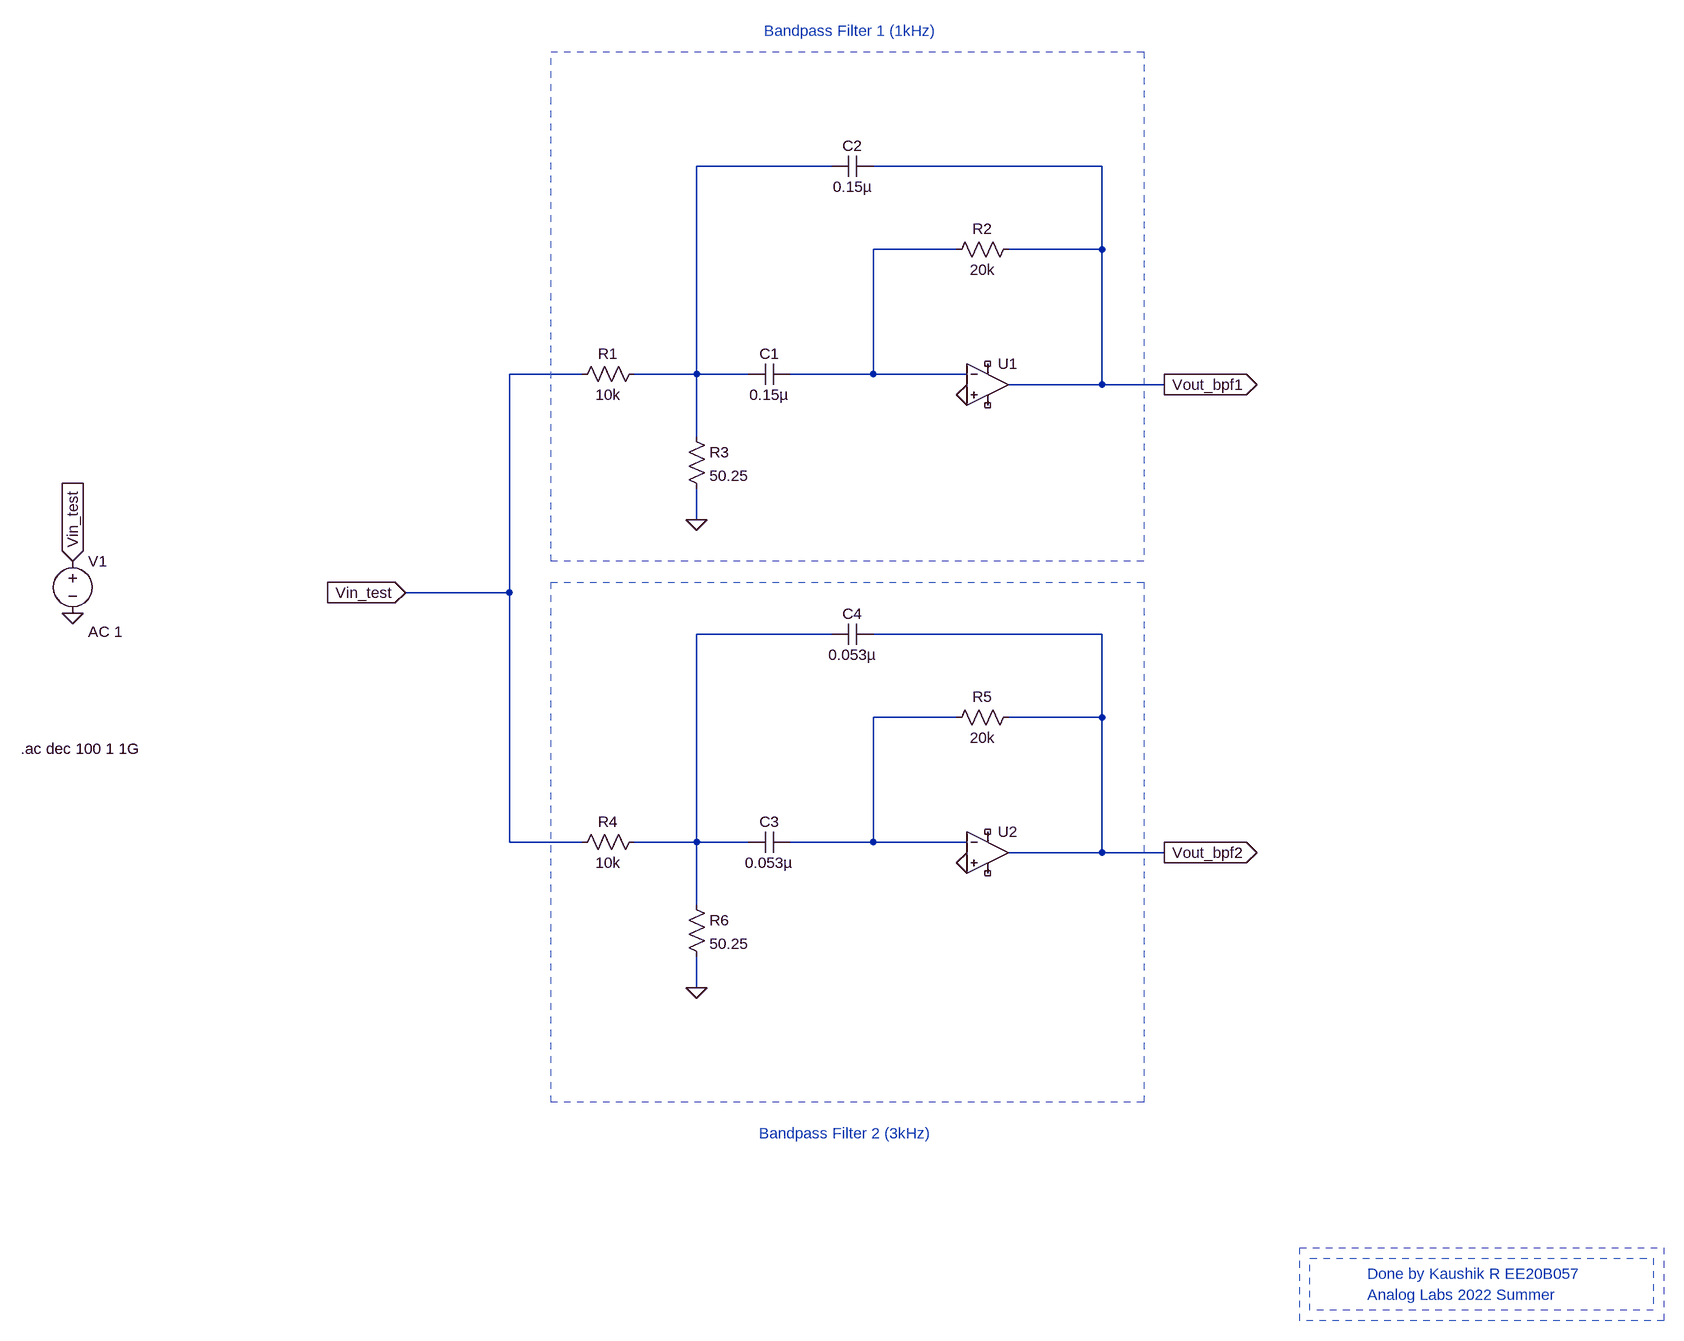
[diagram p0: schematic Exp_6_Bode_Analysis.asc]
Exp_6_Bode_Analysis.asc, the LTspice schematic file:
Version 4
SHEET 1 2004 1428
WIRE 720 -352 512 -352
WIRE 1136 -352 784 -352
WIRE 912 -224 784 -224
WIRE 1136 -224 1136 -352
WIRE 1136 -224 992 -224
WIRE 336 -32 224 -32
WIRE 512 -32 512 -352
WIRE 512 -32 416 -32
WIRE 592 -32 512 -32
WIRE 784 -32 784 -224
WIRE 784 -32 656 -32
WIRE 928 -32 784 -32
WIRE 1136 -16 1136 -224
WIRE 1136 -16 992 -16
WIRE 1232 -16 1136 -16
WIRE 512 64 512 -32
WIRE 512 192 512 144
WIRE 224 304 224 -32
WIRE 224 304 64 304
WIRE 720 368 512 368
WIRE 1136 368 784 368
WIRE 912 496 784 496
WIRE 1136 496 1136 368
WIRE 1136 496 992 496
WIRE 224 688 224 304
WIRE 336 688 224 688
WIRE 512 688 512 368
WIRE 512 688 416 688
WIRE 592 688 512 688
WIRE 784 688 784 496
WIRE 784 688 656 688
WIRE 928 688 784 688
WIRE 1136 704 1136 496
WIRE 1136 704 992 704
WIRE 1232 704 1136 704
WIRE 512 784 512 688
WIRE 512 912 512 864
FLAG 1232 -16 Vout_bpf1
IOPIN 1232 -16 Out
FLAG 512 192 0
FLAG 1232 704 Vout_bpf2
IOPIN 1232 704 Out
FLAG 512 912 0
FLAG 64 304 Vin_test
IOPIN 64 304 In
FLAG -448 336 0
FLAG -448 256 Vin_test
IOPIN -448 256 In
FLAG 928 0 0
FLAG 928 720 0
SYMBOL res 432 -48 R90
WINDOW 0 0 56 VBottom 2
WINDOW 3 32 56 VTop 2
SYMATTR InstName R1
SYMATTR Value 10k
SYMBOL cap 656 -48 R90
WINDOW 0 0 32 VBottom 2
WINDOW 3 32 32 VTop 2
SYMATTR InstName C1
SYMATTR Value 0.15µ
SYMBOL res 1008 -240 R90
WINDOW 0 0 56 VBottom 2
WINDOW 3 32 56 VTop 2
SYMATTR InstName R2
SYMATTR Value 20k
SYMBOL res 496 48 R0
SYMATTR InstName R3
SYMATTR Value 50.25
SYMBOL cap 784 -368 R90
WINDOW 0 0 32 VBottom 2
WINDOW 3 32 32 VTop 2
SYMATTR InstName C2
SYMATTR Value 0.15µ
SYMBOL res 432 672 R90
WINDOW 0 0 56 VBottom 2
WINDOW 3 32 56 VTop 2
SYMATTR InstName R4
SYMATTR Value 10k
SYMBOL cap 656 672 R90
WINDOW 0 0 32 VBottom 2
WINDOW 3 32 32 VTop 2
SYMATTR InstName C3
SYMATTR Value 0.053µ
SYMBOL res 1008 480 R90
WINDOW 0 0 56 VBottom 2
WINDOW 3 32 56 VTop 2
SYMATTR InstName R5
SYMATTR Value 20k
SYMBOL res 496 768 R0
SYMATTR InstName R6
SYMATTR Value 50.25
SYMBOL cap 784 352 R90
WINDOW 0 0 32 VBottom 2
WINDOW 3 32 32 VTop 2
SYMATTR InstName C4
SYMATTR Value 0.053µ
SYMBOL voltage -448 240 R0
WINDOW 123 24 124 Left 2
WINDOW 39 0 0 Left 0
SYMATTR Value2 AC 1
SYMATTR InstName V1
SYMATTR Value ""
SYMBOL OpAmps\\UniversalOpAmp 960 -16 R0
SYMATTR InstName U1
SYMBOL OpAmps\\UniversalOpAmp 960 704 R0
SYMATTR InstName U2
TEXT 616 -560 Left 2 ;Bandpass Filter 1 (1kHz)
TEXT 608 1136 Left 2 ;Bandpass Filter 2 (3kHz)
TEXT -528 544 Left 2 !.ac dec 100 1 1G
TEXT 1544 1352 Left 2 ;Done by Kaushik R EE20B057
TEXT 1544 1384 Left 2 ;Analog Labs 2022 Summer
RECTANGLE Normal 1200 256 288 -528 2
RECTANGLE Normal 1200 1088 288 288 2
RECTANGLE Normal 2000 1424 1440 1312 2
RECTANGLE Normal 1984 1408 1456 1328 2

The netlist it stands for:
* Exp_6_Bode_Analysis.asc
R1 N001 Vin_test 10k
C1 N002 N001 0.15µ
R2 Vout_bpf1 N002 20k
R3 N001 0 50.25
C2 Vout_bpf1 N001 0.15µ
R4 N003 Vin_test 10k
C3 N004 N003 0.053µ
R5 Vout_bpf2 N004 20k
R6 N003 0 50.25
C4 Vout_bpf2 N003 0.053µ
V1 Vin_test 0 AC 1
XU1 0 N002 NC_01 NC_02 Vout_bpf1 level1 Avol=1Meg GBW=10Meg Vos=0 En=0 Enk=0 In=0 Ink=0 Rin=500Meg  ; pins In+ In- V+ V- OUT
XU2 0 N004 NC_03 NC_04 Vout_bpf2 level1 Avol=1Meg GBW=10Meg Vos=0 En=0 Enk=0 In=0 Ink=0 Rin=500Meg  ; pins In+ In- V+ V- OUT
* Bandpass Filter 1 (1kHz)
* Bandpass Filter 2 (3kHz)
.ac dec 100 1 1G
* Done by Kaushik R EE20B057
* Analog Labs 2022 Summer
.lib UniversalOpAmp1.lib
.backanno
.end

* Results of the author's LTspice run, read from the files saved beside the schematic
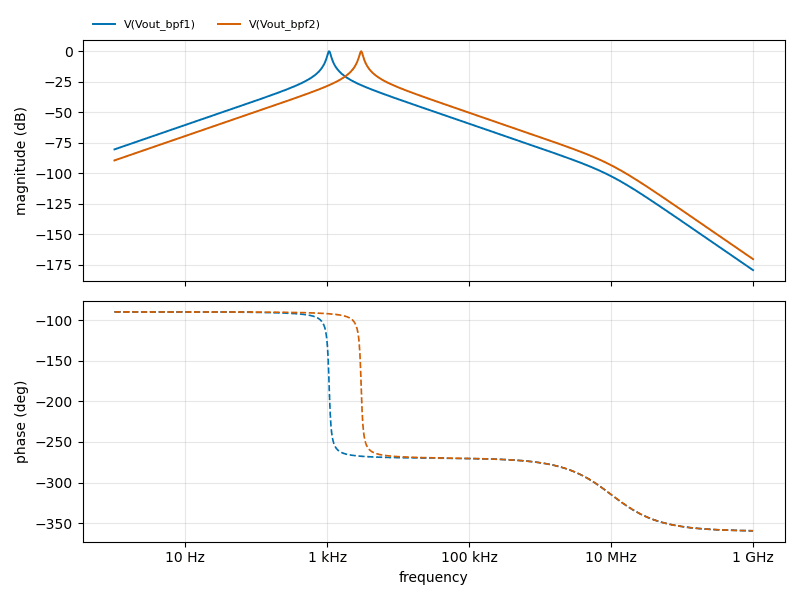
[diagram p1: AC Analysis of Exp_6_Bode_Analysis.asc, plotted from the saved traces]
* AC Analysis, 1 run:
*   V(Vout_bpf1): -80.51 dB at 1 Hz, -179.49 dB at 1 GHz, peak -0.20 dB at 1.072 kHz, 3 dB below the peak at 1.006 kHz and 1.117 kHz
*   V(Vout_bpf2): -89.55 dB at 1 Hz, -170.45 dB at 1 GHz, peak -0.13 dB at 3.02 kHz, 3 dB below the peak at 2.844 kHz and 3.151 kHz